# EAGLE schematic Aqua (EAGLE 7.0.0)
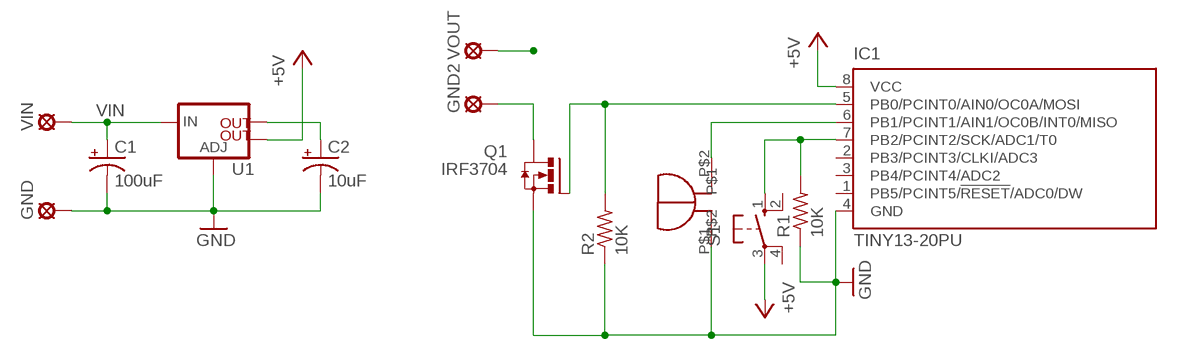
[diagram p0: schematic, sheet 1]

## Parts
C1  100uF  CAP_POLPTH2  [CPOL-RADIAL-10UF-25V]
C2  10uF  CAP_POLPTH2  [CPOL-RADIAL-10UF-25V]
GND  LSP11  [LSP11]
GND2  LSP11  [LSP11]
IC1  TINY13-20PU  [DIL08]
Q1  IRF3704  [TO220AH]
R1  10K  R-US_0207/10  [0207/10]
R2  10K  R-US_0207/10  [0207/10]
S1  10-XX  [B3F-10XX]
U1  V_REG_LM1117SOT223  [SOT223]
U$1  COMPUTER_BUZZERCOMPUTER_BUZZER  [DGGDG]
VIN  LSP11  [LSP11]
VOUT  LSP11  [LSP11]

## Nets
+5V: IC1.8(VCC) S1.3(P) U1.4(OUT)
GND: C1.2(-) C2.2(-) GND.MP IC1.4(GND) Q1.E(S) R1.1 R2.1 U1.1(ADJ) U$1.P$1
N$1: GND2.MP Q1.C(D)
N$2: IC1.6(PB1/PCINT1/AIN1/OC0B/INT0/MISO) U$1.P$2
N$4: IC1.7(PB2/PCINT2/SCK/ADC1/T0) R1.2 S1.1(S)
N$5: IC1.5(PB0/PCINT0/AIN0/OC0A/MOSI) Q1.B(G) R2.2
OUT: C2.1(+) U1.2(OUT)
VIN: C1.1(+) U1.3(IN) VIN.MP VOUT.MP
Unconnected: IC1.1(PB5/PCINT5/!RESET!/ADC0/DW) IC1.2(PB3/PCINT3/CLKI/ADC3) IC1.3(PB4/PCINT4/ADC2) S1.2(S1) S1.4(P1)

## Library data of the parts
C1 C2 = SparkFun-Capacitors:CAP_POL: Capacitor Polarized These are standard SMD and PTH capacitors. Normally 10uF, 47uF, and 100uF in electrolytic and tantalum varieties. Always verify the external diameter of the through hole cap, it varies with capacity, voltage, and manufacturer. The EIA devices should be standard.
GND GND2 VIN VOUT = solpad:LSP11: SOLDER PAD drill 1.1 mm
IC1 = atmel:TINY13: 8-bit AVR Microcontroller with 1K Bytes In-System Programmable Flash Source: http://www.atmel.com/dyn/resources/prod_documents/2535S.pdf; MPN: ATTINY13-20PU; OC_FARNELL: 9171550; OC_NEWARK: 96K6521
Q1 = transistor-power:IRF3704: SMPS MOSFET HEXFET® Power MOSFET Source: http://www.irf.com/product-info/datasheets/data/irf3704.pdf
R1 R2 = adafruit:R-US_: RESISTOR, American symbol
S1 = switch-omron:10-XX: OMRON SWITCH; MPN: B3F-1000; OC_FARNELL: 176432; OC_NEWARK: 36M3542
U1 = SparkFun-PowerIC:V_REG_LM1117: Voltage Regulator LM1117 Standard adjustable voltage regulator but in SMD form. Spark Fun Electronics SKU : COM-00595; PROD_ID: VREG-08170
U$1 = Computer_Buzzer:COMPUTER_BUZZER: Computer Buzzer

## Net classes
0 default: width 0.305 mm, drill 0.508 mm, clearance 0.254 mm